# EAGLE schematic tracker_v3 (EAGLE 9.0.1)
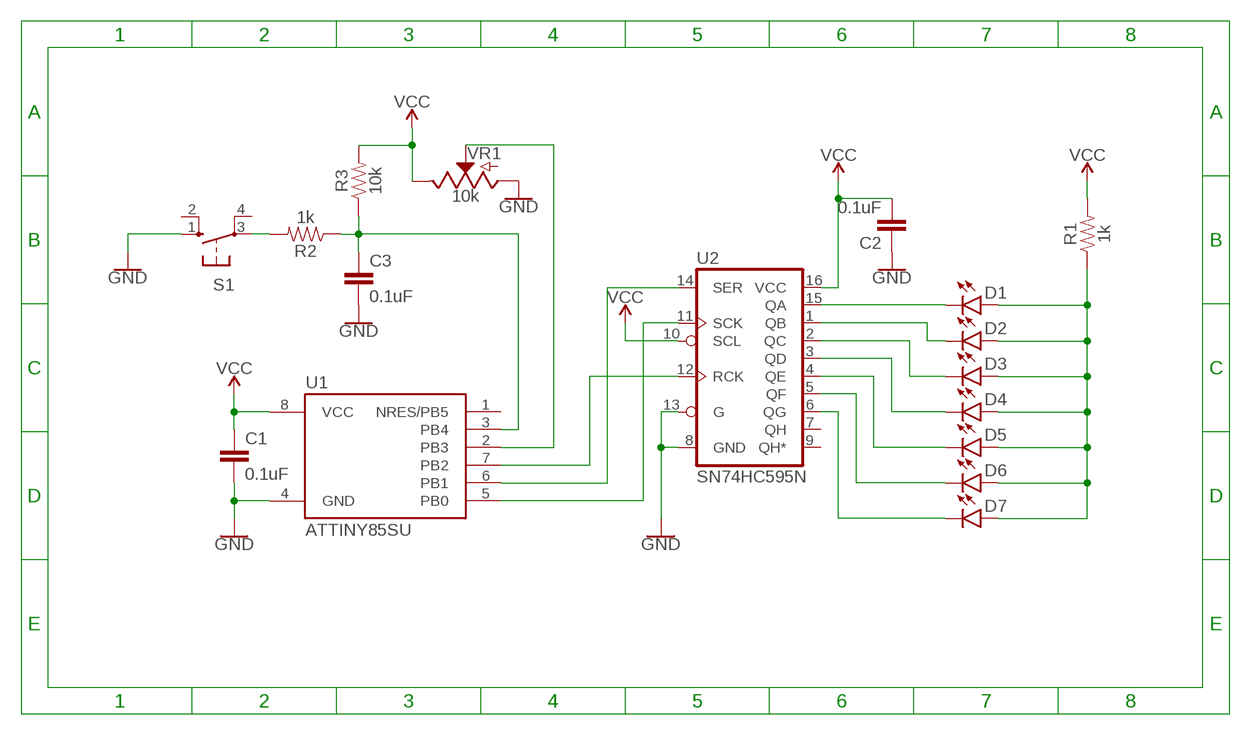
[diagram p0: schematic, sheet 1]

## Parts
C1  0.1uF  0.1UF-0603-25V-(+80/-20%)  [0603]
C2  0.1uF  0.1UF-0603-25V-(+80/-20%)  [0603]
C3  0.1uF  0.1UF-0603-25V-(+80/-20%)  [0603]
D1  LED3MM  [LED_3MM]
D2  LED3MM  [LED_3MM]
D3  LED3MM  [LED_3MM]
D4  LED3MM  [LED_3MM]
D5  LED3MM  [LED_3MM]
D6  LED3MM  [LED_3MM]
D7  LED3MM  [LED_3MM]
R1  1k  1KOHM-HORIZ-1/4W-1%  [AXIAL-0.3]
R2  1k  1KOHM-HORIZ-1/4W-1%  [AXIAL-0.3]
R3  10k  10KOHM-HORIZ-1/4W-1%  [AXIAL-0.3]
S1  10-XX  [B3F-10XX]
U1  ATTINY85SU  [ATTINY85]
U2  SN74HC595N  74HC595N  [DIP16]
VR1  10k  POTENTIOMETER-PTH-9MM-1/20W-20%-KIT  [POT-PTH-ALPS-KIT]

## Nets
GND: C1.2 C2.1 C3.2 S1.1(S) U1.4(GND) U2.8(GND) U2.13(G) VR1.P$3(A)
N$1: D1.A D2.A D3.A D4.A D5.A D6.A D7.A R1.P$1
N$2: D1.K(C) U2.15(QA)
N$3: D2.K(C) U2.1(QB)
N$4: D3.K(C) U2.2(QC)
N$5: D4.K(C) U2.3(QD)
N$6: D5.K(C) U2.4(QE)
N$7: D6.K(C) U2.5(QF)
N$8: D7.K(C) U2.6(QG)
N$9: U1.6(PB1) U2.14(SER)
N$10: C3.1 R2.P$1 R3.P$1 U1.3(PB4)
N$11: U1.5(PB0) U2.11(SCK)
N$12: U1.7(PB2) U2.12(RCK)
N$13: U1.2(PB3) VR1.P$2(S)
N$14: R2.P$2 S1.3(P)
VCC: C1.1 C2.2 R1.P$2 R3.P$2 U1.8(VCC) U2.10(SCL) U2.16(VCC) VR1.P$1(E)
Unconnected: S1.2(S1) S1.4(P1) U1.1(NRES/PB5) U2.7(QH) U2.9(QH*)

## Library data of the parts
C1-C3 = SparkFun-Capacitors:0.1UF: 0.1µF ceramic capacitors A capacitor is a passive two-terminal electrical component used to store electrical energy temporarily in an electric field.; PROD_ID: CAP-00810
D1-D7 = SparkFun-LED:LED: LED (Generic) Standard schematic elements and footprints for 5mm, 3mm, 1206, and 0603 sized LEDs. Generic LEDs with no color specified.; PROD_ID: DIO-08794
R1 R2 = SparkFun-Resistors:1KOHM: 1kΩ resistor A resistor is a passive two-terminal electrical component that implements electrical resistance as a circuit element. Resistors act to reduce current flow, and, at the same time, act to lower voltage levels within circuits. - Wikipedia; PROD_ID: RES-12182
R3 = SparkFun-Resistors:10KOHM: 10kΩ resistor A resistor is a passive two-terminal electrical component that implements electrical resistance as a circuit element. Resistors act to reduce current flow, and, at the same time, act to lower voltage levels within circuits. - Wikipedia; PROD_ID: RES-12183
S1 = switch-omron:10-XX: OMRON SWITCH; MPN: B3F-1000; OC_FARNELL: 176432; OC_NEWARK: 36M3542
U1 = attiny85:ATTINY85: ATMEL ATtiny 85
U2 = SparkFun-IC-Logic:74*595: 8-Bit Shift Register (Serial to Parallel) Datasheet <http://cdn.sparkfun.com/datasheets/BreakoutBoards/MM74HC595.pdf> SparkFun Products SparkFun Shift Register Breakout - 74HC595 <https://www.sparkfun.com/products/10680> (BOB-10680); PROD_ID: IC-13123
VR1 = SparkFun-Resistors:POTENTIOMETER: Potentiometer (Pot) Three-terminal potentiometers, with an adjustable wiper and two adjustable resistors. A pot can be used to create a configurable voltage divider, or as a variable resistor. Variants ALPS_POT and ALPS_POT_KIT - PTH, breadboard compatible, 9mm square pots Rotary Potentiometer - Linear (10k ohm) <https://www.sparkfun.com/products/9288> (COM-09288) The KIT variant exposes copper on only one side of the PTH pad, so the part can only be assembled on one side of the PCB. Useful for beginner soldering kits.; PROD_ID: RES-09177; SF_SKU: COM-09288